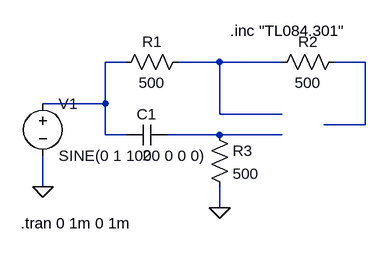
[diagram p0: schematic fase.asc]
fase.asc, the LTspice schematic file:
Version 4
SHEET 1 880 680
WIRE 80 112 48 112
WIRE 224 112 160 112
WIRE 320 112 224 112
WIRE 448 112 400 112
WIRE 48 176 48 112
WIRE 48 176 -48 176
WIRE 224 192 224 112
WIRE 320 192 224 192
WIRE 448 208 448 112
WIRE 448 208 384 208
WIRE 48 224 48 176
WIRE 80 224 48 224
WIRE 224 224 144 224
WIRE 320 224 224 224
WIRE -48 304 -48 256
WIRE 224 336 224 304
FLAG -48 304 0
FLAG 224 336 0
SYMBOL res 176 96 R90
WINDOW 0 0 56 VBottom 2
WINDOW 3 32 56 VTop 2
SYMATTR InstName R1
SYMATTR Value 500
SYMBOL res 416 96 R90
WINDOW 0 0 56 VBottom 2
WINDOW 3 32 56 VTop 2
SYMATTR InstName R2
SYMATTR Value 500
SYMBOL cap 144 208 R90
WINDOW 0 0 32 VBottom 2
WINDOW 3 32 32 VTop 2
SYMATTR InstName C1
SYMATTR Value 2
SYMBOL res 208 208 R0
SYMATTR InstName R3
SYMATTR Value 500
SYMBOL voltage -48 160 R0
WINDOW 123 0 0 Left 0
WINDOW 39 0 0 Left 0
SYMATTR InstName V1
SYMATTR Value SINE(0 1 1000 0 0 0)
TEXT -82 360 Left 2 !.tran 0 1m 0 1m
TEXT 240 64 Left 2 !.inc "TL084.301"

The netlist it stands for:
* fase.asc
R1 N002 N001 500
R2 N003 N002 500
C1 N004 N001 2
R3 N004 0 500
V1 N001 0 SINE(0 1 1000 0 0 0)
.tran 0 1m 0 1m
.inc "TL084.301"
.backanno
.end